# Altium schematic sheet power-v2.2.SchDoc
size A4
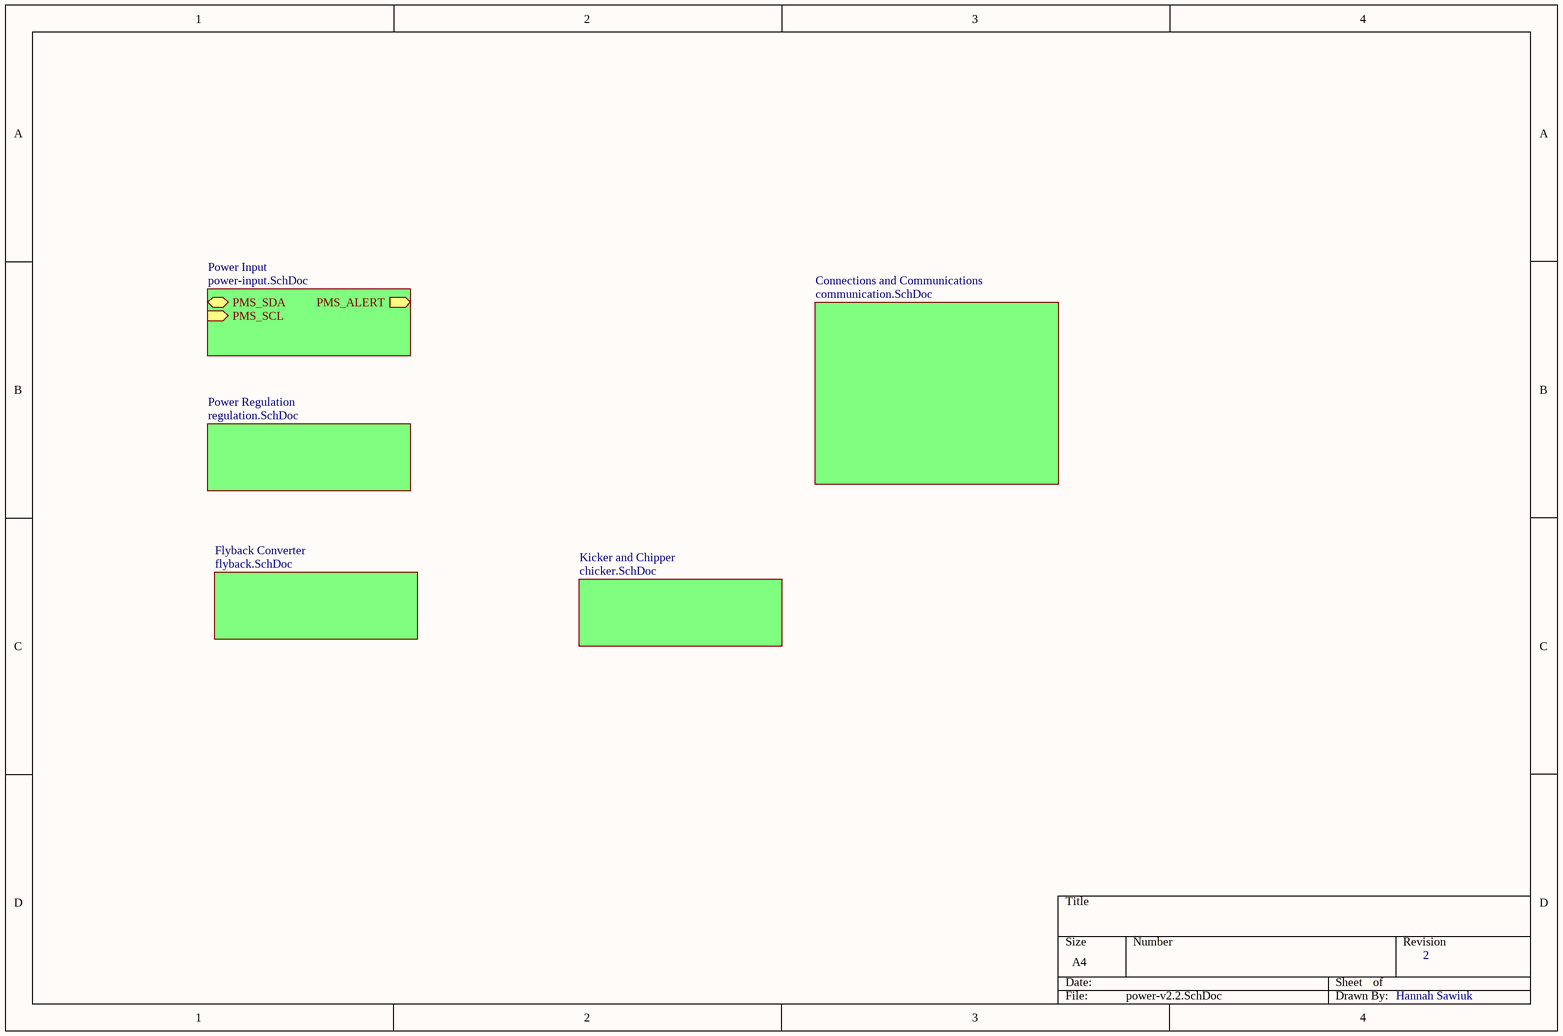
[diagram p0: power-v2.2.SchDoc]

## Sub-sheets
Connections and Communications = communication.SchDoc: no entries
Flyback Converter = flyback.SchDoc: no entries
Kicker and Chipper = chicker.SchDoc: no entries
Power Input = power-input.SchDoc: PMS_SDA (bidir), PMS_SCL (in), PMS_ALERT (out)
Power Regulation = regulation.SchDoc: no entries

## Notes on the sheet
- 2
- Hannah Sawiuk